# EAGLE schematic soraduino_lite (EAGLE 6.2)
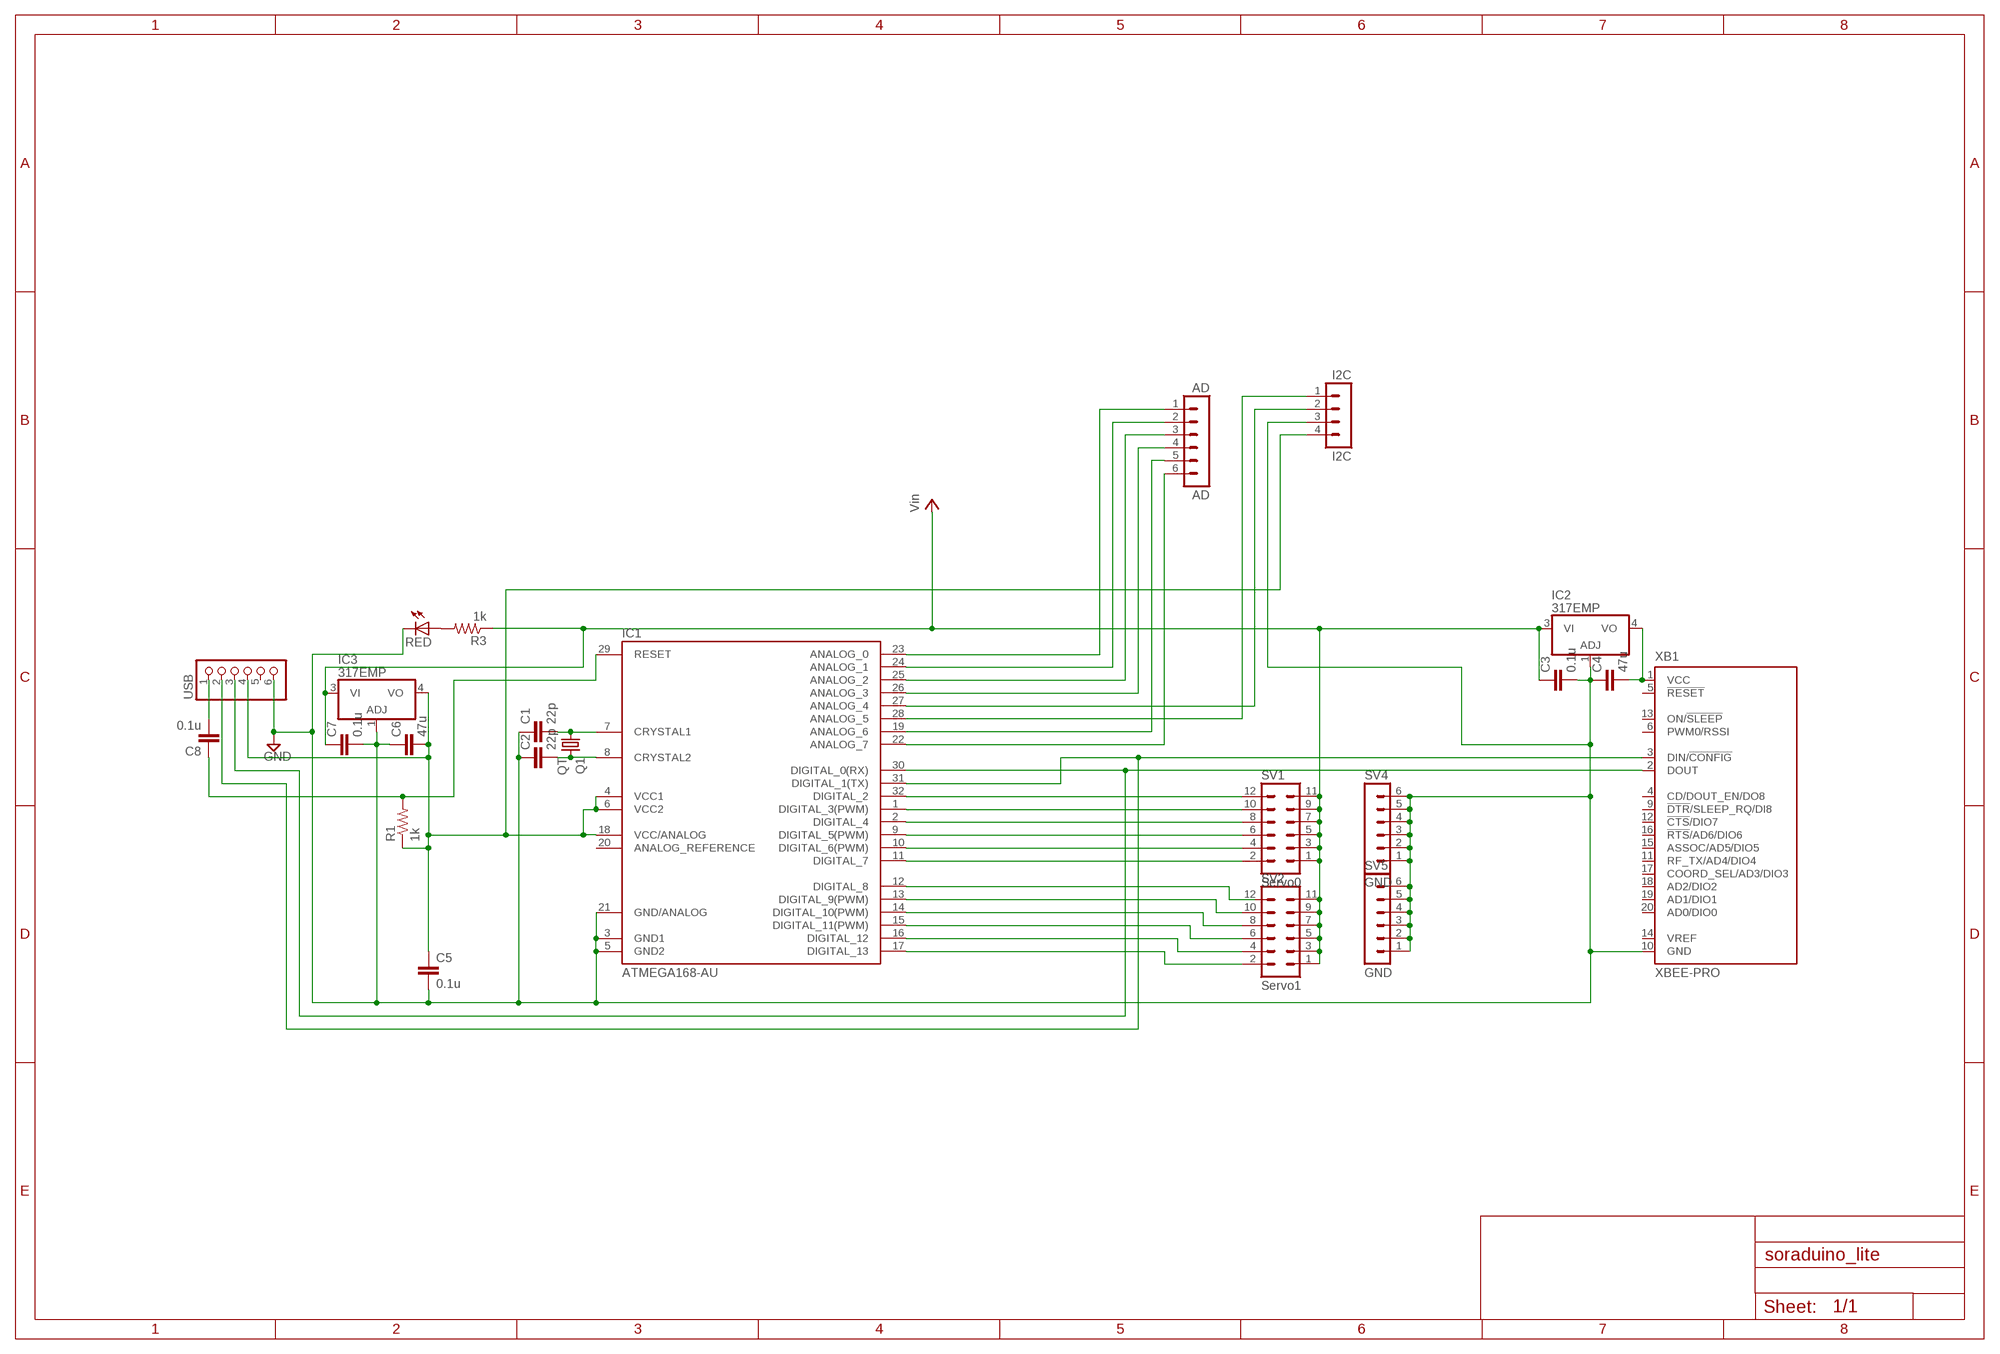
[diagram p0: schematic, sheet 1]

## Parts
AD  AD  MA06-1  [MA06-1]
C1  22p  C-EU050-024X044  [C050-024X044]
C2  22p  C-EU050-024X044  [C050-024X044]
C3  0.1u  C-EUC0805K  [C0805K]
C4  47u  C-EUC0805K  [C0805K]
C5  0.1u  C-EUC0805K  [C0805K]
C6  47u  C-EUC0805K  [C0805K]
C7  0.1u  C-EUC0805K  [C0805K]
C8  0.1u  C-EUC0805K  [C0805K]
I2C  I2C  MA04-1  [MA04-1]
IC1  ATMEGA168-AU  [TQFP32-08]
IC2  317EMP  [SOT223]
IC3  317EMP  [SOT223]
Q1  QT  CRYSTALHC49S  [HC49/S]
R1  1k  R-US_R0603  [R0603]
R3  1k  R-US_R0603  [R0603]
RED  LEDCHIPLED_1206  [CHIPLED_1206]
SV1  Servo0  MA06-2  [MA06-2]
SV2  Servo1  MA06-2  [MA06-2]
SV4  GND  MA06-1  [MA06-1]
SV5  GND  MA06-1  [MA06-1]
USB  PINHD-1X6  [1X06]
XB1  XBEE-PRO  [XBEE-PRO]

## Nets
GND: C1.1 C2.1 C3.2 C4.1 C5.2 C6.1 C7.2 I2C.3 IC1.3(GND1) IC1.5(GND2) IC1.21(GND/ANALOG) IC2.1(ADJ) IC3.1(ADJ) RED.C SV4.1 SV4.2 SV4.3 SV4.4 SV4.5 SV4.6 SV5.1 SV5.2 SV5.3 SV5.4 SV5.5 SV5.6 USB.6 XB1.10(GND)
N$1: C8.2 USB.1
N$2: C8.1 IC1.29(RESET) R1.2
N$3: IC1.30(DIGITAL_0(RX)) USB.3 XB1.2(DOUT)
N$4: C1.2 IC1.7(CRYSTAL1) Q1.1
N$5: C2.2 IC1.8(CRYSTAL2) Q1.2
N$6: C4.2 IC2.4(VO) XB1.1(VCC)
N$7: C5.1 C6.2 I2C.4 IC1.4(VCC1) IC1.6(VCC2) IC1.18(VCC/ANALOG) IC3.4(VO) R1.1 USB.4
N$8: IC1.32(DIGITAL_2) SV1.12
N$9: IC1.1(DIGITAL_3(PWM)) SV1.10
N$10: R3.2 RED.A
N$11: IC1.2(DIGITAL_4) SV1.8
N$12: IC1.9(DIGITAL_5(PWM)) SV1.6
N$13: IC1.10(DIGITAL_6(PWM)) SV1.4
N$14: IC1.11(DIGITAL_7) SV1.2
N$15: IC1.12(DIGITAL_8)
N$16: IC1.13(DIGITAL_9(PWM)) SV2.10
N$17: IC1.14(DIGITAL_10(PWM)) SV2.8
N$18: IC1.15(DIGITAL_11(PWM)) SV2.6
N$19: IC1.16(DIGITAL_12) SV2.4
N$20: IC1.17(DIGITAL_13) SV2.2
N$21: AD.6 IC1.22(ANALOG_7)
N$22: AD.5 IC1.19(ANALOG_6)
N$23: AD.4 IC1.26(ANALOG_3)
N$24: AD.3 IC1.25(ANALOG_2)
N$25: AD.2 IC1.24(ANALOG_1)
N$26: AD.1 IC1.23(ANALOG_0)
N$31: I2C.1 IC1.28(ANALOG_5)
N$32: I2C.2 IC1.27(ANALOG_4)
N$33: IC1.31(DIGITAL_1(TX)) USB.2 XB1.3(DIN/!CONFIG)
VCC: C3.1 C7.1 IC2.3(VI) IC3.3(VI) R3.1 SV1.1 SV1.3 SV1.5 SV1.7 SV1.9 SV1.11 SV2.1 SV2.3 SV2.5 SV2.7 SV2.9 SV2.11 ; supply symbol labelled Vin
Unconnected: IC1.20(ANALOG_REFERENCE) SV2.12 USB.5 XB1.4(CD/DOUT_EN/DO8) XB1.5(!RESET) XB1.6(PWM0/RSSI) XB1.9(!DTR!/SLEEP_RQ/DI8) XB1.11(RF_TX/AD4/DIO4) XB1.12(!CTS!/DIO7) XB1.13(ON/!SLEEP) XB1.14(VREF) XB1.15(ASSOC/AD5/DIO5) XB1.16(!RTS!/AD6/DIO6) XB1.17(COORD_SEL/AD3/DIO3) XB1.18(AD2/DIO2) XB1.19(AD1/DIO1) XB1.20(AD0/DIO0)

## Library data of the parts
AD SV4 SV5 = con-lstb:MA06-1: PIN HEADER; OC_FARNELL: unknown; OC_NEWARK: unknown
C1 C2 = rcl:C-EU: CAPACITOR, European symbol
C3-C8 = resistor:C-EU: CAPACITOR, European symbol
I2C = con-lstb:MA04-1: PIN HEADER; OC_FARNELL: unknown; OC_NEWARK: unknown
IC1 = Arduino-AVR:ATMEGA168
IC2 IC3 = linear:*317: Positive VOLTAGE REGULATOR
Q1 = crystal:CRYSTAL: CRYSTAL; OC_FARNELL: 1667008; OC_NEWARK: unknown
R1 R3 = rcl:R-US_: RESISTOR, American symbol
RED = led:LED: LED OSRAM: - CHIPLED LG R971, LG N971, LY N971, LG Q971, LY Q971, LO R971, LY R971 LH N974, LH R974 LS Q976, LO Q976, LY Q976 LO Q996 - Hyper CHIPLED LW Q18S LB Q993, LB Q99A, LB R99A - SideLED LS A670, LO A670, LY A670, LG A670, LP A670 LB A673, LV A673, LT A673, LW A673 LH A674 LY A675 LS A676, LA A676, LO A676, LY A676, LW A676 LS A679, LY A679, LG A679 - Hyper Micro SIDELED® LS Y876, LA Y876, LO Y876, LY Y876 LT Y87S - SmartLED LW L88C, LW L88S LB L89C, LB L89S, LG L890 LS L89K, LO L89K, LY L89K LS L896, LA L896, LO L896, LY L896 - TOPLED LS T670, LO T670, LY T670, LG T670, LP T670 LSG T670, LSP T670, LSY T670, LOP T670, LYG T670 LG T671, LOG T671, LSG T671 LB T673, LV T673, LT T673, LW T673 LH T674 LS T676, LA T676, LO T676, LY T676, LB T676, LH T676, LSB T676, LW T676 LB T67C, LV T67C, LT T67C, LS T67K, LO T67K, LY T67K, LW E67C LS E67B, LA E67B, LO E67B, LY E67B, LB E67C, LV E67C, LT E67C LW T67C LS T679, LY T679, LG T679 LS T770, LO T770, LY T770, LG T770, LP T770 LB T773, LV T773, LT T773, LW T773 LH T774 LS E675, LA E675, LY E675, LS T675 LS T776, LA T776, LO T776, LY T776, LB T776 LHGB T686 LT T68C, LB T68C - Hyper Mini TOPLED® LB M676 - Mini TOPLED Santana® LG M470 LS M47K, LO M47K, LY M47K Source: http://www.osram.convergy.de LUXEON: - LUMILED® LXK2-PW12-R00, LXK2-PW12-S00, LXK2-PW14-U00, LXK2-PW14-V00 LXK2-PM12-R00, LXK2-PM12-S00, LXK2-PM14-U00 LXK2-PE12-Q00, LXK2-PE12-R00, LXK2-PE12-S00, LXK2-PE14-T00, LXK2-PE14-U00 LXK2-PB12-K00, LXK2-PB12-L00, LXK2-PB12-M00, LXK2-PB14-N00, LXK2-PB14-P00, LXK2-PB14-Q00 LXK2-PR12-L00, LXK2-PR12-M00, LXK2-PR14-Q00, LXK2-PR14-R00 LXK2-PD12-Q00, LXK2-PD12-R00, LXK2-PD12-S00 LXK2-PH12-R00, LXK2-PH12-S00 LXK2-PL12-P00, LXK2-PL12-Q00, LXK2-PL12-R00 Source: www.luxeon.com KINGBRIGHT: KA-3528ASYC Source: www.kingbright.com
SV1 SV2 = con-lstb:MA06-2: PIN HEADER; OC_FARNELL: unknown; OC_NEWARK: unknown
USB = pinhead:PINHD-1X6: PIN HEADER
XB1 = maxstream:XBEE: XBee (TM) /XBee-PRO(TM) OEM RF Modules Source: MaxStream, Inc. xbee_productmanual.pdf; MPN: XBP24-AWI-001; OC_FARNELL: 1337916; OC_NEWARK: 42M2667